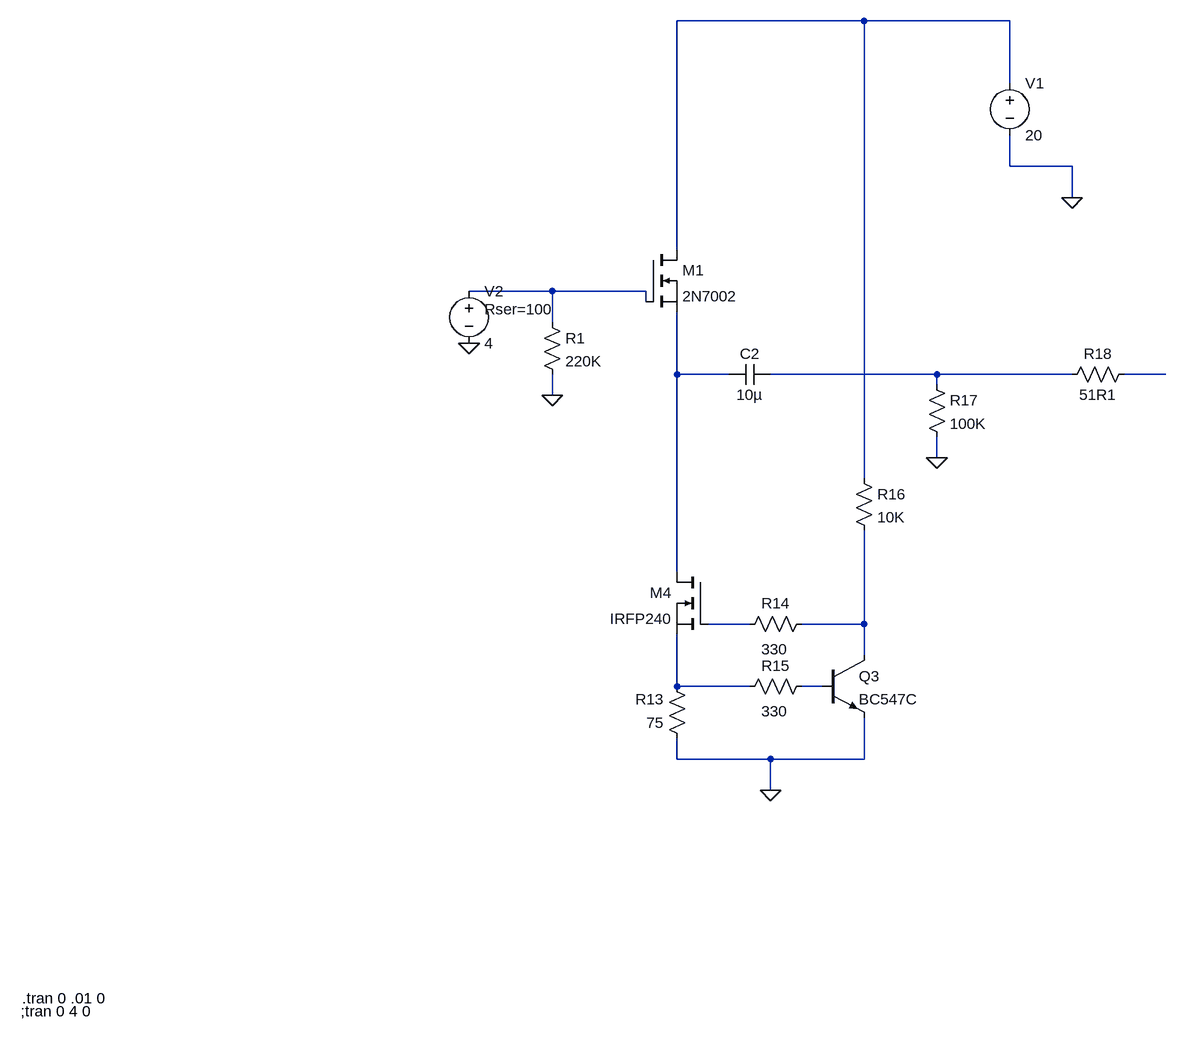
[diagram p0: schematic Copy of PASSD1.asc]
Copy of PASSD1.asc, the LTspice schematic file:
Version 4
SHEET 1 1596 1060
WIRE 816 -656 528 -656
WIRE 1040 -656 816 -656
WIRE 1040 -560 1040 -656
WIRE 1040 -432 1040 -480
WIRE 1136 -432 1040 -432
WIRE 1136 -384 1136 -432
WIRE 528 -304 528 -656
WIRE 336 -240 208 -240
WIRE 480 -240 336 -240
WIRE 480 -224 480 -240
WIRE 336 -192 336 -240
WIRE 528 -112 528 -208
WIRE 608 -112 528 -112
WIRE 928 -112 672 -112
WIRE 1136 -112 928 -112
WIRE 1280 -112 1216 -112
WIRE 928 -96 928 -112
WIRE 336 -80 336 -112
WIRE 928 16 928 -16
WIRE 816 48 816 -656
WIRE 528 192 528 -112
WIRE 640 272 576 272
WIRE 816 272 816 128
WIRE 816 272 720 272
WIRE 816 320 816 272
WIRE 528 368 528 288
WIRE 640 368 528 368
WIRE 752 368 720 368
WIRE 528 480 528 448
WIRE 672 480 528 480
WIRE 816 480 816 416
WIRE 816 480 672 480
WIRE 672 528 672 480
FLAG 1136 -384 0
FLAG 928 16 0
FLAG 336 -80 0
FLAG 672 528 0
FLAG 208 -160 0
SYMBOL nmos 576 192 M0
SYMATTR InstName M4
SYMATTR Value IRFP240
SYMBOL res 544 464 R180
WINDOW 0 36 76 Left 2
WINDOW 3 36 40 Left 2
SYMATTR InstName R13
SYMATTR Value 75
SYMBOL res 736 256 R90
WINDOW 0 0 56 VBottom 2
WINDOW 3 39 58 VTop 2
SYMATTR InstName R14
SYMATTR Value 330
SYMBOL res 736 352 R90
WINDOW 0 0 56 VBottom 2
WINDOW 3 39 58 VTop 2
SYMATTR InstName R15
SYMATTR Value 330
SYMBOL npn 752 320 R0
SYMATTR InstName Q3
SYMATTR Value BC547C
SYMBOL res 800 32 R0
SYMATTR InstName R16
SYMATTR Value 10K
SYMBOL voltage 1040 -576 R0
WINDOW 123 0 0 Left 2
WINDOW 39 0 0 Left 2
SYMATTR InstName V1
SYMATTR Value 20
SYMBOL cap 672 -128 R90
WINDOW 0 0 32 VBottom 2
WINDOW 3 32 32 VTop 2
SYMATTR InstName C2
SYMATTR Value 10µ
SYMATTR SpiceLine V=600 Irms=0
SYMBOL res 912 -112 R0
SYMATTR InstName R17
SYMATTR Value 100K
SYMBOL res 1232 -128 R90
WINDOW 0 0 56 VBottom 2
WINDOW 3 32 56 VTop 2
SYMATTR InstName R18
SYMATTR Value 51R1
SYMBOL res 320 -208 R0
SYMATTR InstName R1
SYMATTR Value 220K
SYMBOL nmos 480 -304 R0
SYMATTR InstName M1
SYMATTR Value 2N7002
SYMBOL voltage 208 -256 R0
WINDOW 123 0 0 Left 2
WINDOW 39 24 44 Left 2
SYMATTR SpiceLine Rser=100
SYMATTR InstName V2
SYMATTR Value 4
TEXT -480 848 Left 2 !.tran 0 .01 0
TEXT -482 868 Left 2 !;tran 0 4 0

The netlist it stands for:
* Copy of PASSD1.asc
M4 N003 N006 N008 N008 IRFP240
R13 0 N008 75
R14 N007 N006 330
R15 N009 N008 330
Q3 N007 N009 0 0 BC547C
R16 N001 N007 10K
V1 N001 0 20
C2 N004 N003 10µ V=600 Irms=0
R17 N004 0 100K
R18 N005 N004 51R1
R1 N002 0 220K
M1 N001 N002 N003 N003 2N7002
V2 N002 0 4 Rser=100
.model NPN NPN
.model PNP PNP
.lib standard.bjt
.model NMOS NMOS
.model PMOS PMOS
.lib standard.mos
.tran 0 .01 0
;tran 0 4 0
.backanno
.end